# Altium schematic sheet sineytin.SchDoc
size A2
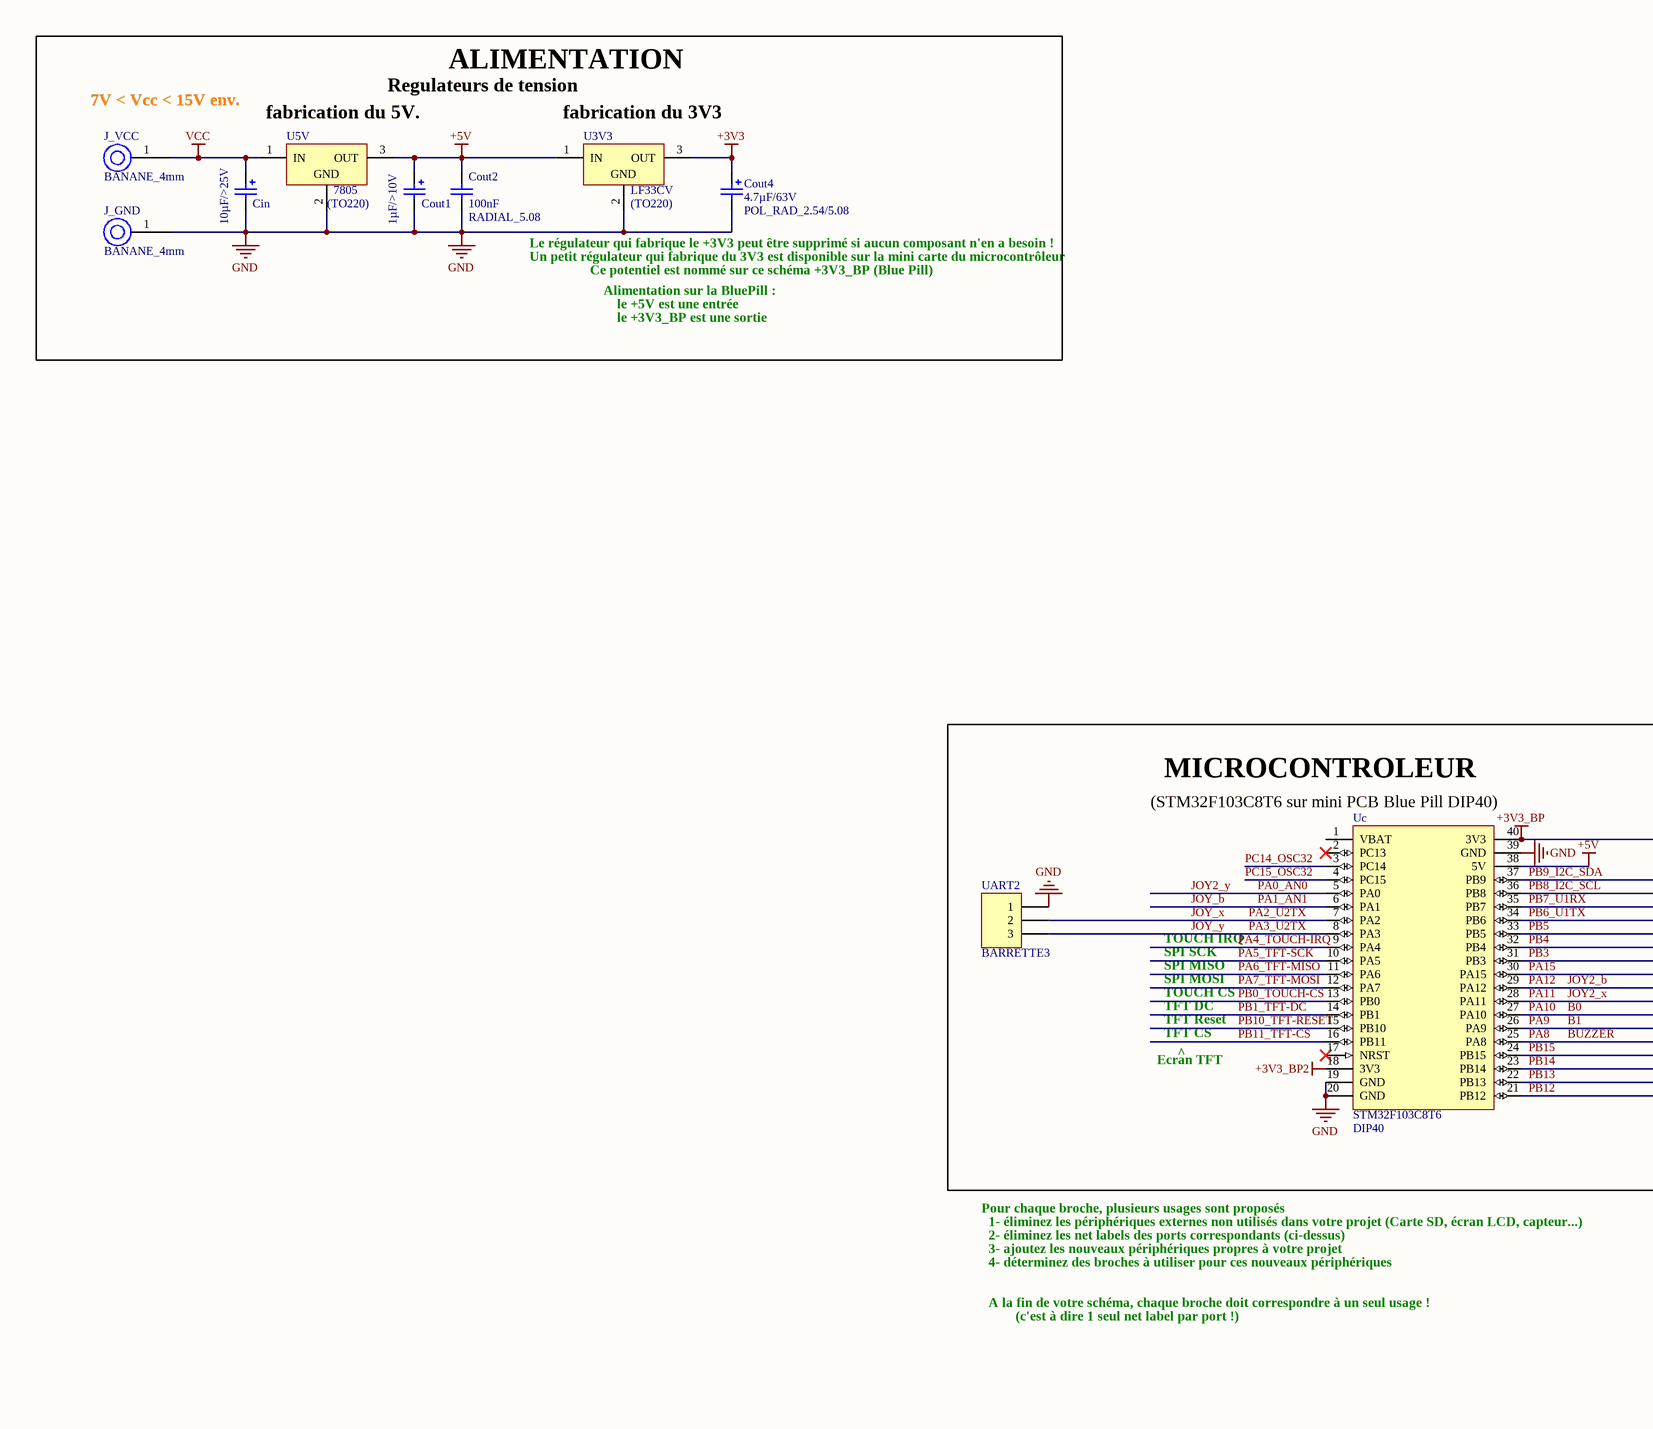
[diagram p0: sineytin.SchDoc, left]
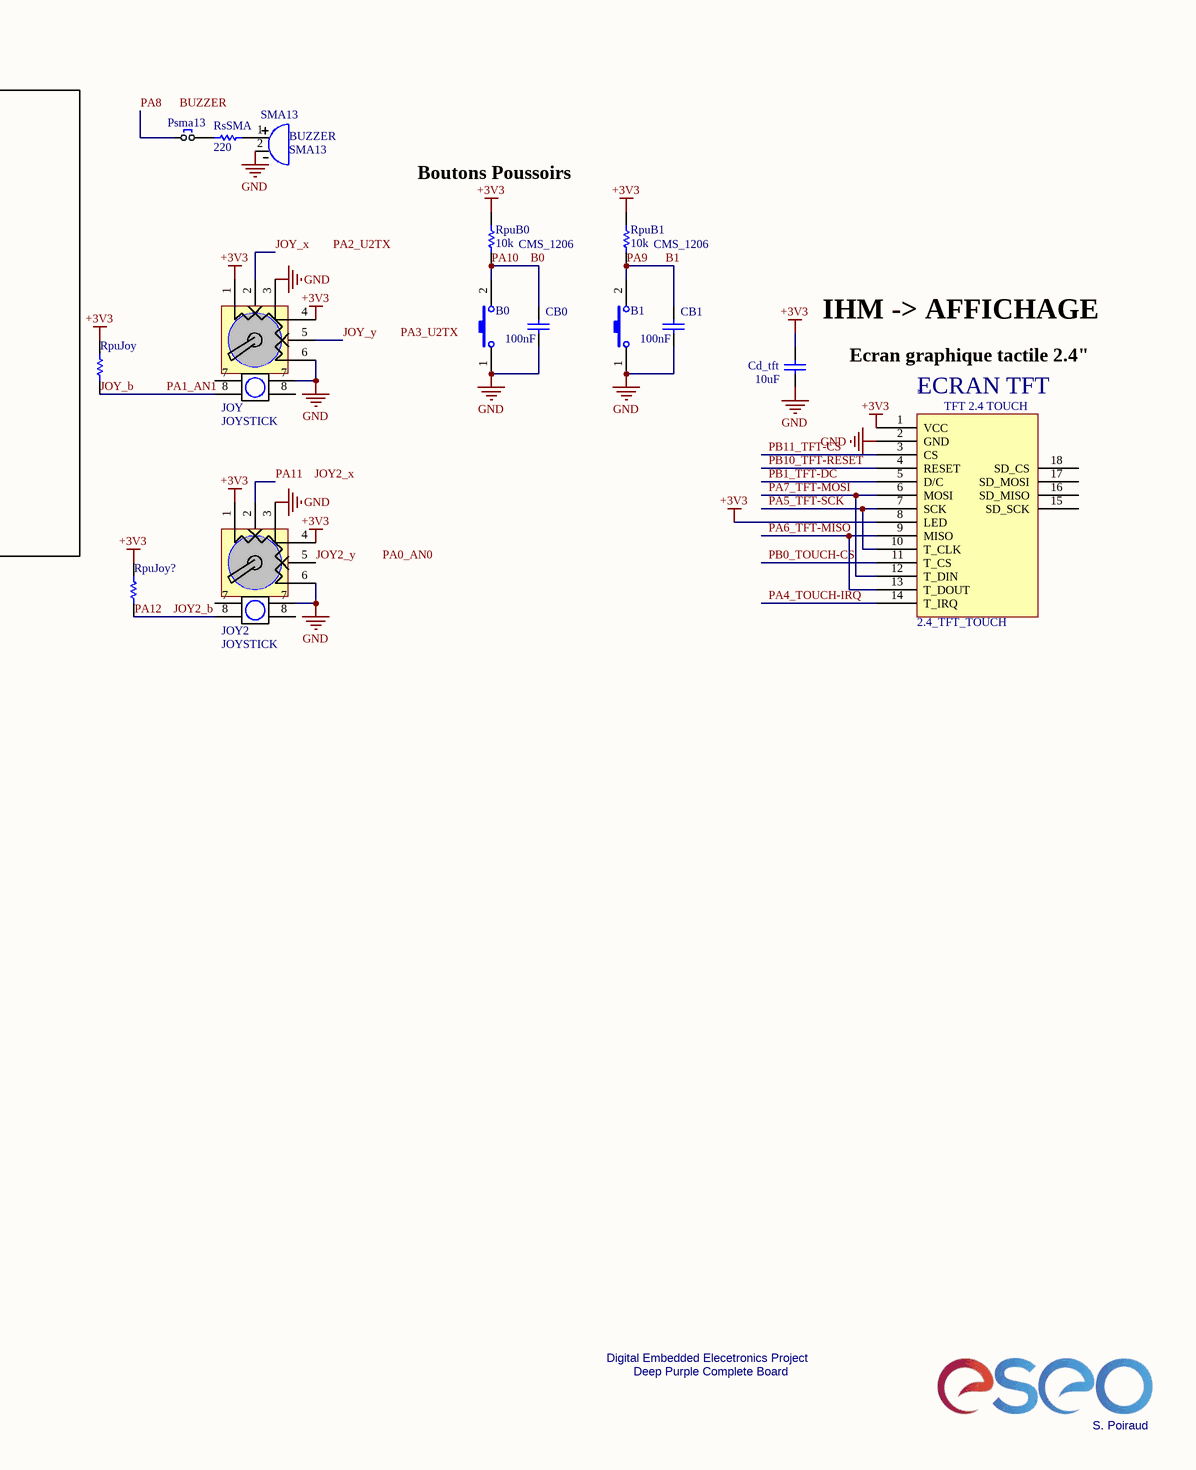
[diagram p1: sineytin.SchDoc, right]

## Parts
*  2.4_TFT_TOUCH  [2.4_TFT_TOUCH]
B0  BOUTON_POUSSOIR_MINIATURE_TRAVERSANT  [BOUTON_POUSSE_PLAT_6x6]  (value not drawn)
B1  BOUTON_POUSSOIR_MINIATURE_TRAVERSANT  [BOUTON_POUSSE_PLAT_6x6]  (value not drawn)
CB0  value 100nF  [C0805_N]  (hidden comment: Condensateur 0805)
CB1  value 100nF  [C0805_N]  (hidden comment: Condensateur 0805)
Cd_tft  10uF  [CONDENSATEUR_POLARISE_ELECTROLYTIQUE_RADIAL_2.54/5.08]
Cin  value 10µF/>25V  [CONDENSATEUR_POLARISE_ELECTROLYTIQUE_RADIAL_2.0/5.08]  (hidden comment: CONDENSATEUR_POL_ELECTROLY_RAD_2.0/5.08)
Cout1  value 1µF/>10V  [CONDENSATEUR_POLARISE_ELECTROLYTIQUE_RADIAL_2.0/5.08]  (hidden comment: CONDENSATEUR_POL_ELECTROLY_RAD_2.0/5.08)
Cout2  value 100nF  Type: RADIAL_5.08  [CONDENSATEUR_CERAMIQUE_RADIAL_5.08]  (hidden comment: CONDENSATEUR_CER_RAD_5.08)
Cout4  value 4.7µF/63V  Type: POL_RAD_2.54/5.08  [CONDENSATEUR_POLARISE_ELECTROLYTIQUE_RADIAL_2.54/5.08]  (hidden comment: CONDENSATEUR_POL_ELECTROLY_RAD_2.54/5.08)
J_GND  Type: BANANE_4mm  [DOUILLE_BANANE_4mm]  (hidden comment: DOUILLE BANANE 4mm)
J_VCC  Type: BANANE_4mm  [DOUILLE_BANANE_4mm]  (hidden comment: DOUILLE BANANE 4mm)
JOY  Type: JOYSTICK  [JOYSTICK_MINI - avec Switch]  (hidden comment: JOYSTICK_MINI_AVEC_SWITCH)
JOY2  Type: JOYSTICK  [JOYSTICK_MINI - avec Switch]  (hidden comment: JOYSTICK_MINI_AVEC_SWITCH)
Psma13  Jumper SIP 2.54  [HDR1X2]  (value not drawn)
RpuB0  value 10k  Type: CMS_1206  [RESISTANCE_CMS_1206]  (hidden comment: RESISTANCE_CMS_1206)
RpuB1  value 10k  Type: CMS_1206  [RESISTANCE_CMS_1206]  (hidden comment: RESISTANCE_CMS_1206)
RpuJoy  RESISTANCE_CMS_1206  [RESISTANCE_CMS_1206]  (value not drawn)
RpuJoy?  RESISTANCE_CMS_1206  [RESISTANCE_CMS_1206]  (value not drawn)
RsSMA  220  [R1206_N]
SMA13  value SMA13  Type: BUZZER  [BUZZER_SMA13]  (hidden comment: BUZZER_SMA13)
U3V3  Type: LF33CV  Package: (TO220)  [REGULATEUR_TO220_78XX]  (hidden comment: REGULATEUR_TO220_78XX)
U5V  Type: 7805  Package: (TO220)  [REGULATEUR_TO220_78XX]  (hidden comment: REGULATEUR_TO220_78XX)
UART2  BARRETTE3  [HDR1X3]
Uc  Type: STM32F103C8T6  Package: DIP40  [STM32F103C8T6_DIP40]  (hidden comment: STM32F103C8T6/PCB_DIP40)

## Blocks framed on the sheet
ALIMENTATION: Cin Cout1 Cout2 Cout4 J_GND J_VCC U3V3 U5V
MICROCONTROLEUR: UART2 Uc

## Nets
+3V3: *.1(VCC) *.8(LED) Cd_tft.1 Cout4.1 JOY.1 JOY.4 JOY2.1 JOY2.4 RpuB0.2 RpuB1.2 RpuJoy.2 RpuJoy?.2 U3V3.3(OUT)
+3V3_BP: Uc.40(3V3)
+3V3_BP2: Uc.18(3V3)
+5V: Cout1.1 Cout2.2 U3V3.1(IN) U5V.3(OUT) Uc.38(5V)
GND: *.2(GND) B0.1 B1.1 CB0.1 CB1.1 Cd_tft.2 Cin.2 Cout1.2 Cout2.1 Cout4.2 J_GND.1 JOY.3 JOY.6 JOY.7 JOY2.3 JOY2.6 JOY2.7 SMA13.2 U3V3.2(GND) U5V.2(GND) UART2.1 Uc.19(GND) Uc.20(GND) Uc.39(GND)
VCC: Cin.1 J_VCC.1 U5V.1(IN)
JOY2_y         PA0_AN0: JOY2.5 Uc.5(PA0)
JOY_b           PA1_AN1: JOY.8 RpuJoy.1 Uc.6(PA1)
JOY_x        PA2_U2TX: JOY.2 UART2.2 Uc.7(PA2)
JOY_y        PA3_U2TX: JOY.5 UART2.3 Uc.8(PA3)
PA4_TOUCH-IRQ: *.14(T_IRQ) Uc.9(PA4)
PA5_TFT-SCK: *.7(SCK) *.10(T_CLK) Uc.10(PA5)
PA6_TFT-MISO: *.9(MISO) *.13(T_DOUT) Uc.11(PA6)
PA7_TFT-MOSI: *.6(MOSI) *.12(T_DIN) Uc.12(PA7)
PA8      BUZZER: Psma13.1 Uc.25(PA8)
PA9      B1: B1.2 CB1.2 RpuB1.1 Uc.26(PA9)
PA10    B0: B0.2 CB0.2 RpuB0.1 Uc.27(PA10)
PA11    JOY2_x: JOY2.2 Uc.28(PA11)
PA12    JOY2_b: JOY2.8 RpuJoy?.1 Uc.29(PA12)
PA15: Uc.30(PA15)
PB0_TOUCH-CS: *.11(T_CS) Uc.13(PB0)
PB1_TFT-DC: *.5(D/C) Uc.14(PB1)
PB3: Uc.31(PB3)
PB4: Uc.32(PB4)
PB5: Uc.33(PB5)
PB6_U1TX: Uc.34(PB6)
PB7_U1RX: Uc.35(PB7)
PB8_I2C_SCL: Uc.36(PB8)
PB9_I2C_SDA: Uc.37(PB9)
PB10_TFT-RESET: *.4(RESET) Uc.15(PB10)
PB11_TFT-CS: *.3(CS) Uc.16(PB11)
PB12: Uc.21(PB12)
PB13: Uc.22(PB13)
PB14: Uc.23(PB14)
PB15: Uc.24(PB15)
PC14_OSC32: Uc.3(PC14)
PC15_OSC32: Uc.4(PC15)
NetPsma13_2: Psma13.2 RsSMA.2
NetRsSMA_1: RsSMA.1 SMA13.1

Not connected (* = marked no-connect by the designer): * 15(SD_SCK) 16(SD_MISO) 17(SD_MOSI) 18(SD_CS); Uc 1(VBAT) 2(PC13)* 17(NRST)*

## Notes on the sheet
- 7V < Vcc < 15V env.
- Regulateurs de tension
- (near U5V) fabrication du 5V.
- (near U3V3) fabrication du 3V3
- Le régulateur qui fabrique le +3V3 peut être supprimé si aucun composant n'en a besoin !
- Un petit régulateur qui fabrique du 3V3 est disponible sur la mini carte du microcontrôleur
- Ce potentiel est nommé sur ce schéma +3V3_BP (Blue Pill)
- Alimentation sur la BluePill :
- le +5V est une entrée
- le +3V3_BP est une sortie
- (near Uc) (STM32F103C8T6 sur mini PCB Blue Pill DIP40)
- Boutons Poussoirs
- SPI SCK
- SPI MISO
- SPI MOSI
- TOUCH IRQ
- (near Cd_tft) IHM -> AFFICHAGE
- TOUCH CS
- TFT DC
- TFT Reset
- TFT CS
- ^
- Ecran graphique tactile 2.4"
- (near *) ECRAN TFT
- Ecran TFT
- Pour chaque broche, plusieurs usages sont proposés
- 1- éliminez les périphériques externes non utilisés dans votre projet (Carte SD, écran LCD, capteur...)
- 2- éliminez les net labels des ports correspondants (ci-dessus)
- 3- ajoutez les nouveaux périphériques propres à votre projet
- 4- déterminez des broches à utiliser pour ces nouveaux périphériques
- A la fin de votre schéma, chaque broche doit correspondre à un seul usage !
- (c'est à dire 1 seul net label par port !)
- Digital Embedded Elecetronics Project
- Deep Purple Complete Board
- S. Poiraud
- Title
- Size:
- Date:
- File:
- A2
- Number:
- Time:
- Revision:
- Sheet
- of
- (in symbol 2.4_TFT_TOUCH) TFT 2.4 TOUCH

## Library data of the parts
B0 B1 = BOUTON_POUSSOIR_MINIATURE_TRAVERSANT: BOUTON POUSSOIR MINIATURE TRAVERSANT ON/OFF; Type: B_POUSS_MINI_T
CB0 CB1 = CONDENSATEUR_CER_RAD_5.08: Type: RADIAL_5.08
Cd_tft = Condensateur: Capacitor; Published: 8-Jun-2000; LatestRevisionDate: 17-Jul-2002; LatestRevisionNote: Re-released for DXP Platform.; PackageReference: RAD-0.3; Publisher: Altium Limited
Cin Cout1 = CONDENSATEUR_POL_ELECTROLY_RAD_2.0/5.08: CONDENSATEUR POLARISE ELECTROLYTIQUE RADIAL 2.0/5.08; Type: POL_RAD_2.0/5.08
Cout2 = CONDENSATEUR_CER_RAD_5.08: CONDENSATEUR TRAVERSANT CERAMIQUE RADIAL 5.08mm
Cout4 = CONDENSATEUR_POL_ELECTROLY_RAD_2.54/5.08: CONDENSATEUR POLARISE ELECTROLYTIQUE RADIAL 2.54/5.08
J_GND J_VCC = DOUILLE_BANANE_4mm: DOUILLE BANANE 4 mm
JOY JOY2 = JOYSTICK_MINI_AVEC_SWITCH: JOYSTICK POTENTIOMETRIQUE MINIATURE RKJXK122000D
Psma13 = Jumper SIP2.54
RpuB0 RpuB1 = RESISTANCE_CMS_1206: RESISTANCE CMS 1206
RpuJoy RpuJoy? = RESISTANCE_CMS_1206: RESISTANCE CMS 1206; Value: 10k; Type: CMS_1206
RsSMA = Resistor: Published: 8-Jun-2000; LatestRevisionDate: 17-Jul-2002; LatestRevisionNote: Re-released for DXP Platform.; PackageReference: AXIAL-0.5; Publisher: Altium Limited
SMA13 = BUZZER_SMA13: BUZZER SMA13
U3V3 U5V = REGULATEUR_TO220_78XX: REGULATEUR DE TENSION POSITIVE 78XX BOITIER TO220
UART2 = BARRETTE3: Header, 3-Pin; LatestRevisionDate: 17-Jul-2002; LatestRevisionNote: Re-released for DXP Platform.; Publisher: Altium Limited
Uc = STM32F103C8T6/PCB_DIP40: MICROCONTROLEUR 32 BITS - 72MHz - 34 I/O - 64 KO : FLASH - 20KO RAM - 10 CANAUX A/D 12 BITS - DIP40 - UART, SPI, I2C, USB, CAN